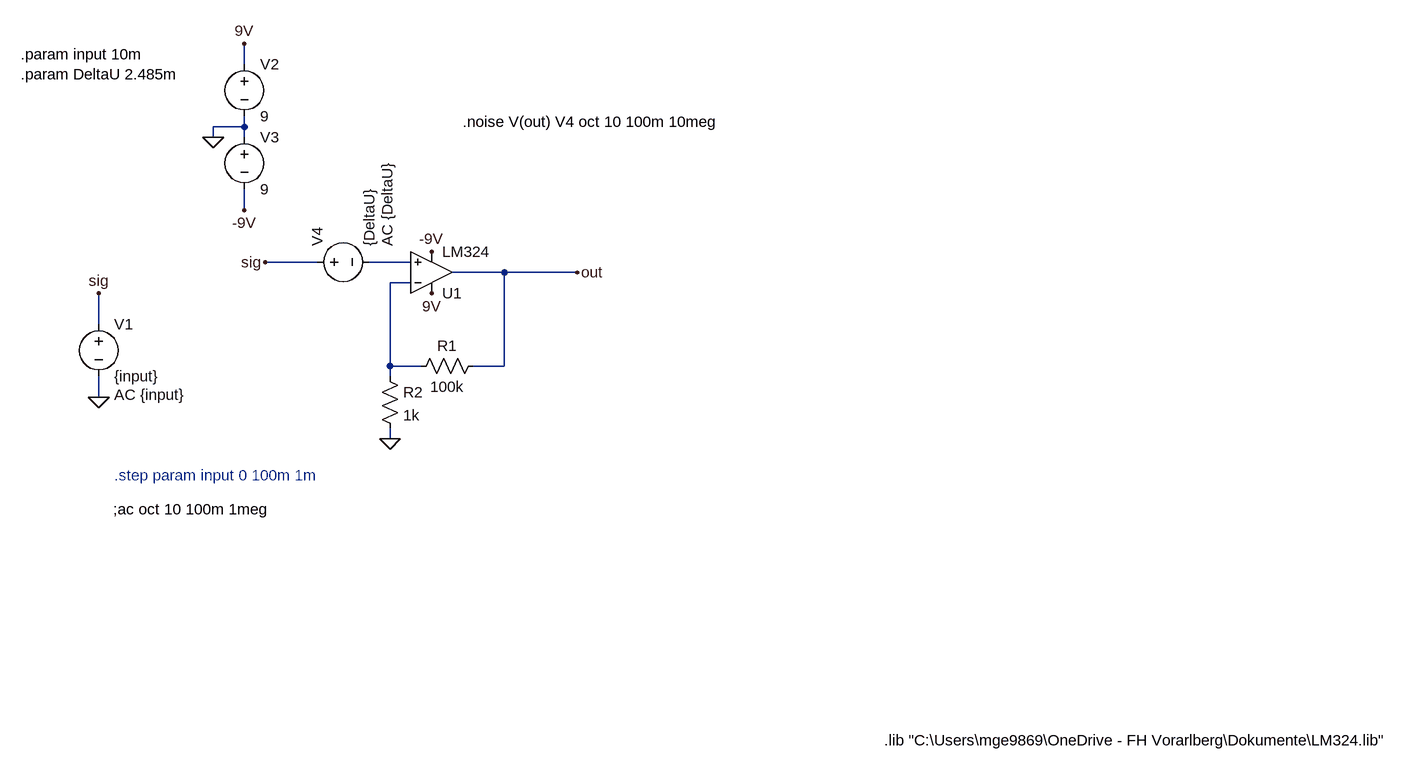
[diagram p0: schematic MessverstaerkerLab10.asc]
MessverstaerkerLab10.asc, the LTspice schematic file:
Version 4
SHEET 1 2032 772
WIRE 176 -304 176 -336
WIRE 176 -208 176 -224
WIRE 176 -208 128 -208
WIRE 128 -192 128 -208
WIRE 176 -192 176 -208
WIRE 176 -80 176 -112
WIRE 288 0 208 0
WIRE 432 0 368 0
WIRE 576 16 496 16
WIRE 688 16 576 16
WIRE 432 32 400 32
WIRE -48 96 -48 48
WIRE 400 160 400 32
WIRE 448 160 400 160
WIRE 576 160 576 16
WIRE 576 160 528 160
WIRE 400 176 400 160
WIRE -48 208 -48 176
WIRE 400 272 400 256
FLAG 128 -192 0
FLAG 176 -80 -9V
FLAG 176 -336 9V
FLAG -48 208 0
FLAG -48 48 sig
FLAG 400 272 0
FLAG 688 16 out
FLAG 464 48 9V
FLAG 464 -16 -9V
FLAG 208 0 sig
SYMBOL voltage -48 80 R0
WINDOW 123 24 124 Left 2
WINDOW 39 24 124 Left 2
SYMATTR InstName V1
SYMATTR Value {input}
SYMATTR Value2 AC {input}
SYMBOL voltage 176 -320 R0
WINDOW 123 0 0 Left 0
WINDOW 39 0 0 Left 0
SYMATTR InstName V2
SYMATTR Value 9
SYMBOL voltage 176 -208 R0
WINDOW 123 0 0 Left 0
WINDOW 39 0 0 Left 0
SYMATTR InstName V3
SYMATTR Value 9
SYMBOL OpAmps\\opamp2 464 80 M180
SYMATTR InstName U1
SYMATTR Value LM324
SYMBOL res 544 144 R90
WINDOW 0 0 56 VBottom 2
WINDOW 3 32 56 VTop 2
SYMATTR InstName R1
SYMATTR Value 100k
SYMBOL res 384 160 R0
SYMATTR InstName R2
SYMATTR Value 1k
SYMBOL voltage 272 0 R270
WINDOW 123 24 124 Left 2
WINDOW 39 0 0 Left 0
SYMATTR InstName V4
SYMATTR Value {DeltaU}
SYMATTR Value2 AC {DeltaU}
TEXT 1160 736 Left 2 !.lib "C:\\Users\\mge9869\\OneDrive - FH Vorarlberg\\Dokumente\\LM324.lib"
TEXT -26 380 Left 2 !;ac oct 10 100m 1meg
TEXT -24 328 Left 2 ;.step param input 0 100m 1m
TEXT -168 -320 Left 2 !.param input 10m\n.param DeltaU 2.485m
TEXT 512 -216 Left 2 !.noise V(out) V4 oct 10 100m 10meg

The netlist it stands for:
* MessverstaerkerLab10.asc
V1 sig 0 {input} AC {input}
V2 9V 0 9
V3 0 -9V 9
XU1 N001 N002 9V -9V out LM324  ; pins In+ In- V+ V- OUT
R1 out N002 100k
R2 N002 0 1k
V4 sig N001 {DeltaU} AC {DeltaU}
.lib "C:\Users\mge9869\OneDrive - FH Vorarlberg\Dokumente\LM324.lib"
;ac oct 10 100m 1meg
* .step param input 0 100m 1m
.param input 10m
.param DeltaU 2.485m
.noise V(out) V4 oct 10 100m 10meg
.backanno
.end